# EasyEDA Pro project ProPrj_HEMY 2.0_2025-04-23.epro, schematic HEMY Brake Driver 1.1
Board Name: HEMY Brake Driver 1.1; Create Date: 2025-04-08; Page Name: Board; Project Name: HEMY 2.0; Schematic Name: HEMY Brake Driver 1.1; Update Date: 2025-04-08; Company: Club Astro Vélizy; Drawn: polvinc; Page Size: A5; Part Number: HEMY_BRAKE_001; Reviewed: polvinc; Version: V1.1
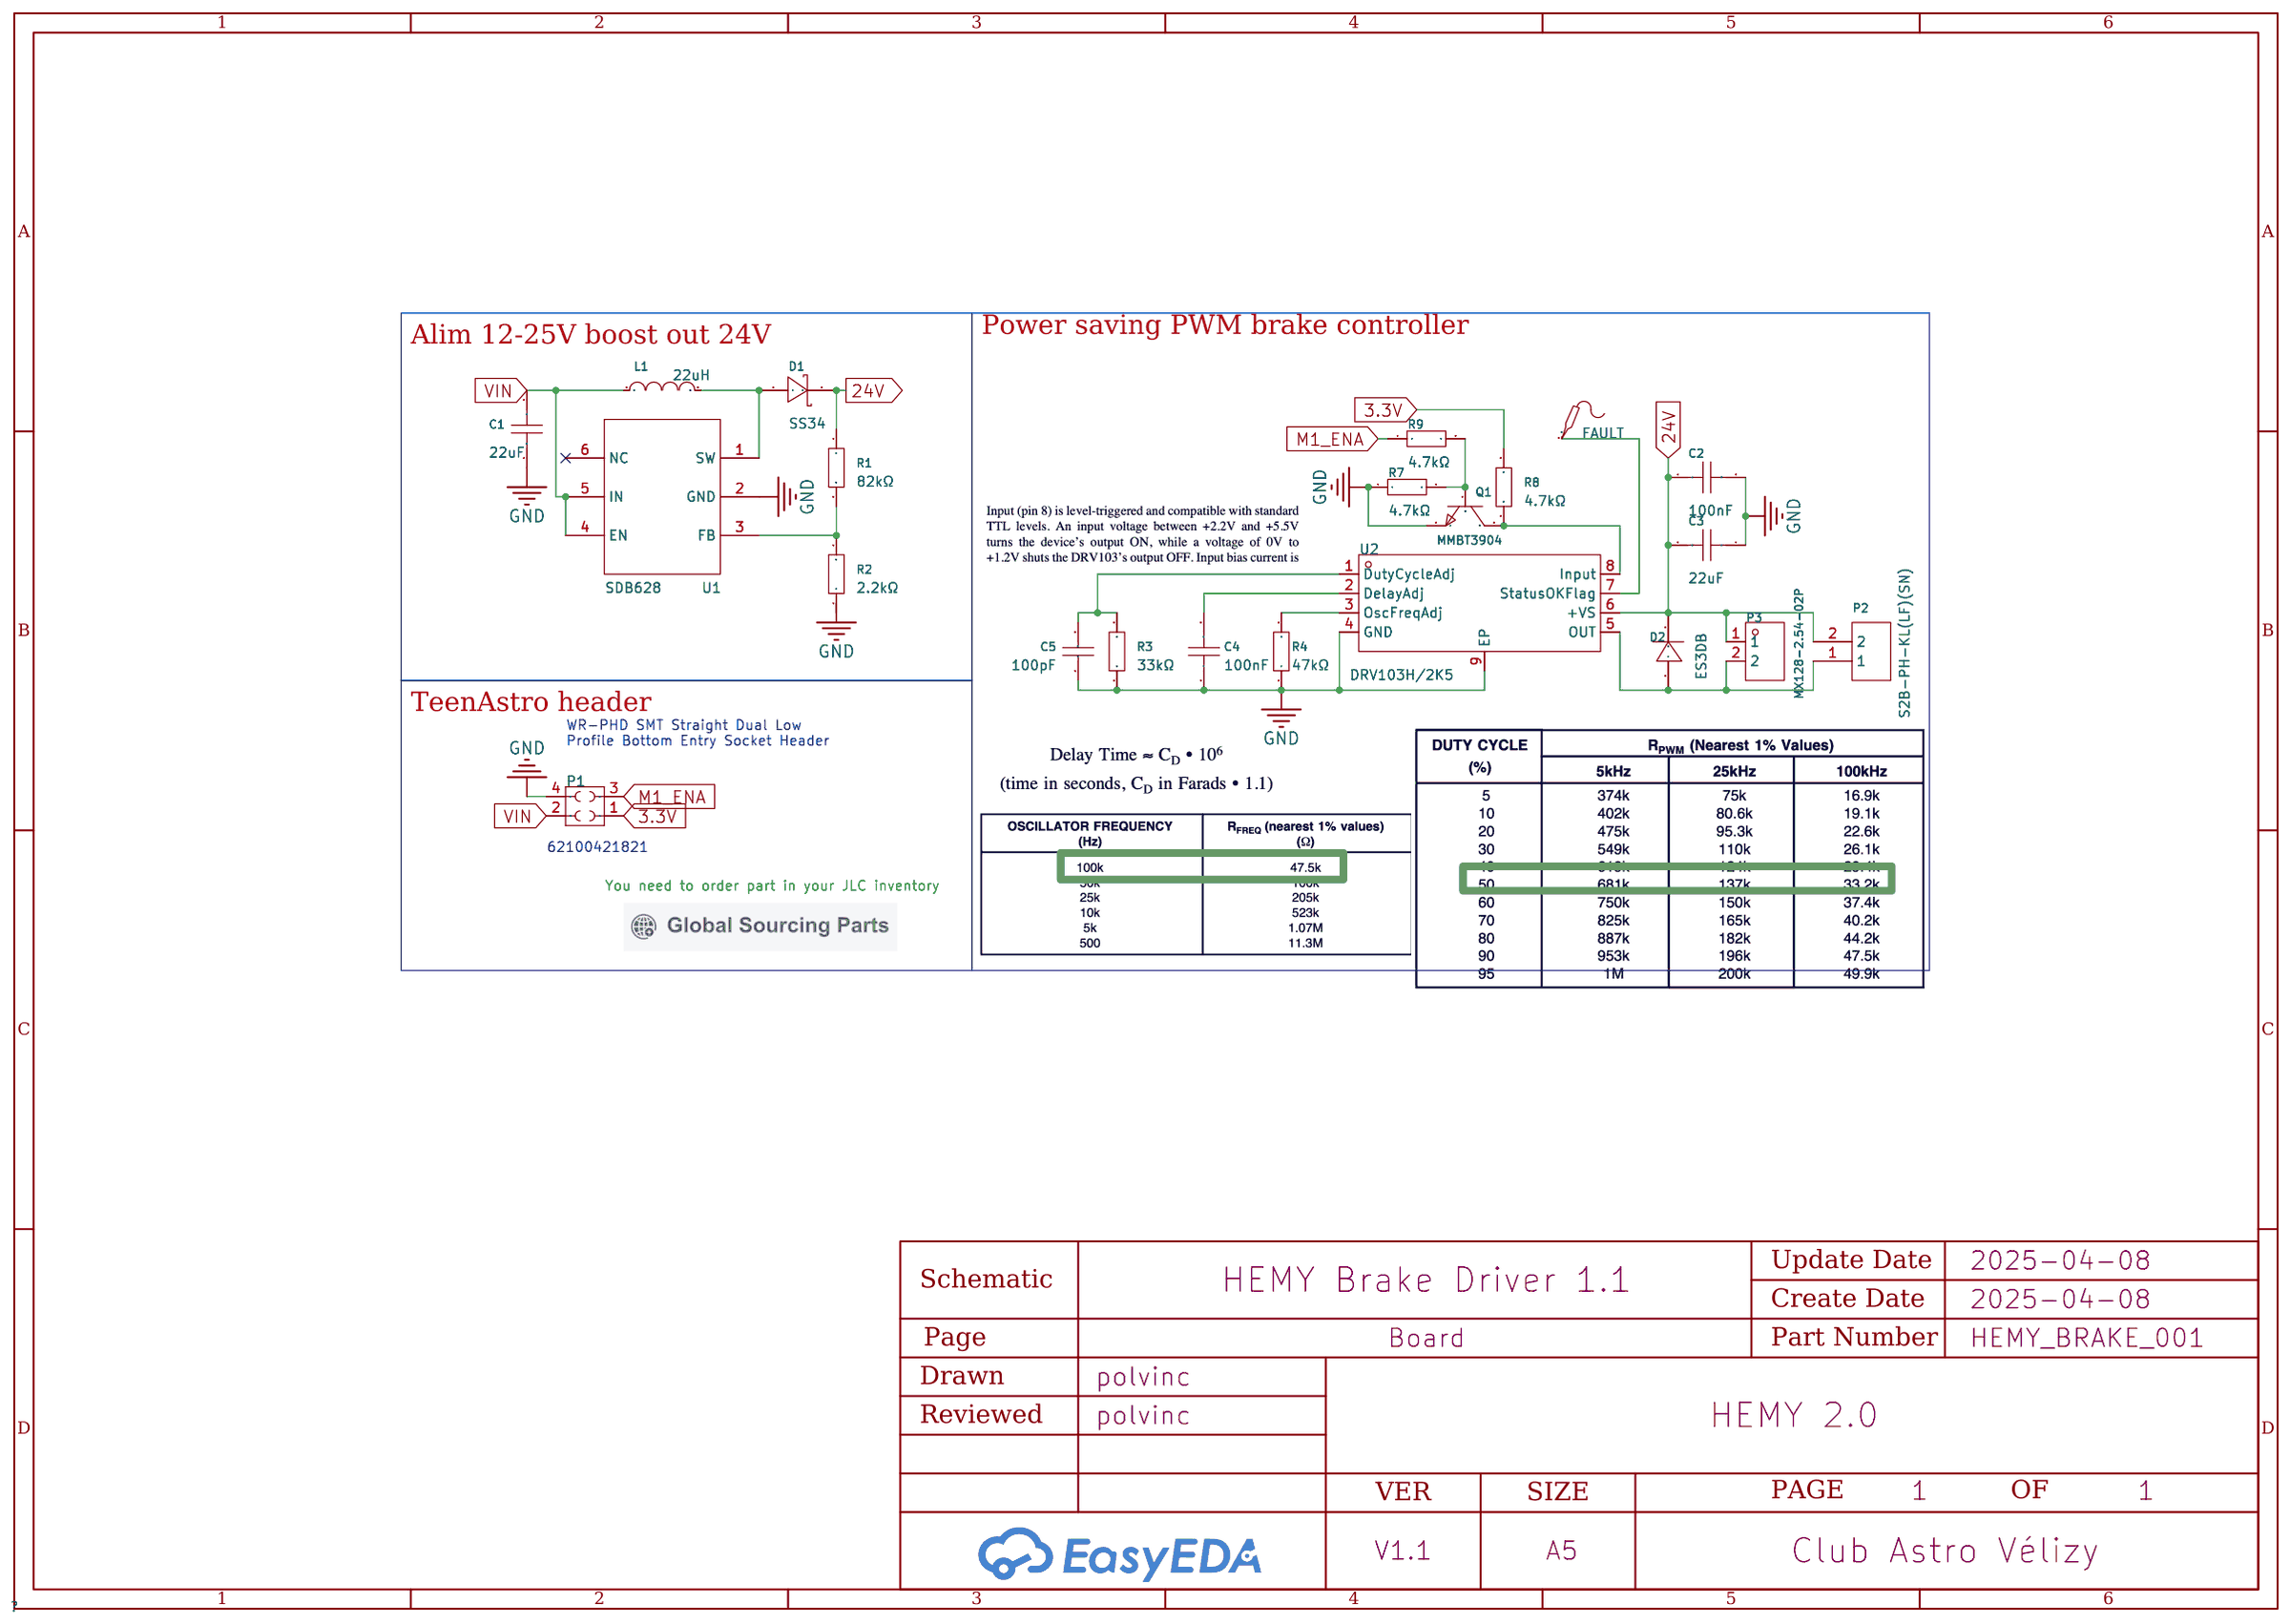
[diagram p2: schematic sheet]

## Parts
C1  22uF  [C0805]
C2  100nF  [C0805]
C3  22uF  [C0805]
C4  100nF  [C0603]
C5  100pF  [C0603]
D1  SS34  [SMA_L4.3-W2.6-LS5.2-RD]
D2  ES3DB  [SMB_L4.6-W3.6-LS5.3-RD]
FAULT  -  [Test-Point-0.5mm]
L1  22uH  [IND-SMD_L7.1-W6.6]
P1  -  [62100421821]
P2  S2B-PH-KL(LF)(SN)  [CONN-TH-2P-P2.00_S2B-PH-KL-LF-SN]  (no BOM)
P3  MX128-2.54-02P  [CONN-TH_2P-P2.54_MX128-2.54-GN01-02P-CU-Y-A]
Q1  MMBT3904  [SOT-23-3_L2.9-W1.3-P1.90-LS2.4-BR]
R1  82kΩ  [R0603]
R2  2.2kΩ  [R0603]
R3  33kΩ  [R0603]
R4  47kΩ  [R0603]
R7  4.7kΩ  [R0603]
R8  4.7kΩ  [R0603]
R9  4.7kΩ  [R0603]
U1  SDB628  [SOT-23-6_L2.9-W1.6-P0.95-LS2.8-BR]
U2  DRV103H/2K5  [SOIC-8_L4.9-W3.9-P1.27-LS6.0-BL-EP2.3]

## Library data of the parts
C1 C3 = CGA0805X5R226M350MT: Capacitance:22uF Tolerance:±20% Tolerance:±20% Voltage Rated: Temperature Coefficient:; LCSC Part Name: 22uF ±20% 35V; Supplier Part: C6119901; Manufacturer: HRE(芯声); Supplier Footprint: 0805; JLCPCB Part Class: Extended Part; Datasheet: https://atta.szlcsc.com/upload/public/pdf/source/20231129/D589D0CC4D260F7AC3A77E53B455CCB3.pdf; Supplier: LCSC; Tolerance: ±20%
C2 = CC0805KRX7R9BB104: Capacitance: Tolerance:±10% Tolerance:±10% Voltage Rated: Temperature Coefficient:; LCSC Part Name: 100nF ±10% 50V; Supplier Part: C49678; Manufacturer: YAGEO(国巨); Supplier Footprint: 0805; JLCPCB Part Class: Basic Part; Datasheet: https://atta.szlcsc.com/upload/public/pdf/source/20180224/C181747_15194369449651363981.pdf; Supplier: LCSC; Tolerance: ±10%
C4 = CC0603KRX7R9BB104: Capacitance: Tolerance:±10% Tolerance:±10% Voltage Rated: Temperature Coefficient:; LCSC Part Name: 100nF±10%50V; Supplier Part: C14663; Manufacturer: YAGEO(国巨); Supplier Footprint: 0603; JLCPCB Part Class: BasicPart; Datasheet: https://atta.szlcsc.com/upload/public/pdf/source/20180910/C282072_33301C7F631E79921B82A8DAC6BCC5B3.pdf; Supplier: LCSC; Tolerance: ±10%
C5 = CL10C101JB8NNNC: Capacitance: Tolerance:±5% Tolerance:±5% Voltage Rated: Temperature Coefficient:; LCSC Part Name: 100pF ±5% 50V; Supplier Part: C14858; Manufacturer: SAMSUNG(三星); Supplier Footprint: 0603; JLCPCB Part Class: Basic Part; Datasheet: https://atta.szlcsc.com/upload/public/pdf/source/20160103/1457707672333.pdf; Supplier: LCSC; Tolerance: ±5%
D1 = SS34_C8678: Diode Configuration:Single Forward Voltage (Vf@If):550mV@3A Reverse Voltage (Vr):40V Rectified Current:3A Reverse Leakage Current (Ir):500uA@40V; LCSC Part Name: 电压:40V 电流:3A; Supplier Part: C8678; Manufacturer: MDD(辰达半导体); Supplier Footprint: SMA(DO-214AC); JLCPCB Part Class: Basic Part; Datasheet: https://atta.szlcsc.com/upload/public/pdf/source/20230314/A80AE34493C69B89E2F4B1712F433538.pdf; Supplier: LCSC; Diode Configuration: Single; Forward Voltage (Vf@If): 550mV@3A; Reverse Voltage (Vr): 40V; Rectified Current: 3A; Reverse Leakage Current (Ir): 500uA@40V
D2 = ES3DB_C64975: Diode Configuration: Forward Voltage (Vf@If):1V@3A Reverse Voltage (Vr): Rectified Current: Reverse Leakage Current:5uA@200V Reverse Recovery Time (trr): Operating Temperature:-55℃~+150℃@(Tj) Operating Temperature:-55℃~+150℃@(Tj); LCSC Part Name: 电压:200V 电流:3A; Supplier Part: C64975; Manufacturer: MDD(辰达半导体); Supplier Footprint: DO-214AA(SMB); JLCPCB Part Class: Extended Part; Datasheet: https://atta.szlcsc.com/upload/public/pdf/source/20230314/57528205CBDE1D6077C2A8DCDEEC193A.pdf; Supplier: LCSC; Forward Voltage (Vf@If): 1V@3A; Reverse Leakage Current: 5uA@200V; Operating Temperature: -55℃~+150℃@(Tj)
FAULT = Test-Point: Test Point 测试点
L1 = YSPI0630A-220M: Inductance: Tolerance:±20% Tolerance:±20% Rated Current: DC Resistance (DCR):; LCSC Part Name: 22uH ±20%; Supplier Part: C497873; Manufacturer: YJYCOIN(益嘉源); Supplier Footprint: SMD,6.6x7.1mm; JLCPCB Part Class: Extended Part; Datasheet: https://atta.szlcsc.com/upload/public/pdf/source/20200317/C497869_D09F597887D5FB8B541C5C98B400E286.pdf; Supplier: LCSC; Tolerance: ±20%
P1 = 6210XX21821_62100421821_
P2 = S2B-PH-KL(LF)(SN): Pins Structure:1x2P Pitch:2mm Mounting Style:Right-Angle Reference Series:PH Number of Pins:2P Number of Rows:1 Number of PINs Per Row:2 Row Spacing:- Current Rating (Max):2A Contact Material:Copper Alloy Contact Plating:Tin Operating Temperature Range:-2; LCSC Part Name: 1x2P 间距:2mm 弯插 系列:PH; Supplier Part: C160237; Manufacturer: JST; Supplier Footprint: 弯插,P=2mm; JLCPCB Part Class: Extended Part; Datasheet: https://atta.szlcsc.com/upload/public/pdf/source/20181010/C265101_22107ACC4D8714694FDA2DD97145FA81.pdf; Supplier: LCSC; Pins Structure: 1x2P; Pitch: 2mm; Mounting Style: Right-Angle; Reference Series: PH; Number of Pins: 2P; Number of Rows: 1; Number of PINs Per Row: 2; Current Rating (Max): 2A; Contact Material: Copper Alloy; Contact Plating: Tin; Operating Temperature Range: -25℃~+85℃; Rated Voltage (Max): 100V; Plastic Material: PA66; Flame Retardant Rating: UL94V-0; Supplementary Features: 打K脚; Colour: Gray; Z-Height of the Board: 4.8mm; X-Length of Bottom Edge on Board (Spacing Line): 5.9mm; Y-Width of Bottom Edge on Board: 7.6mm
P3 = MX128-2.54-02P-GN01-Cu-Y-A: Structure:1x2P Pitch:2.54mm Color:Green Mounting Style:Straight Current Rating (Max):6A Voltage Rating (Max):150V Number of Pins:2P Number of Rows:1 Wire Gauge - AWG:18~24 Wire Gauge - AWG:18~24 Wire Gauge - mm2:1 Wire Gauge - mm2:1 Number of PINs Per Row; LCSC Part Name: 2.54mm 1x2P 排数:1 每排P数:2 直插; Supplier Part: C5188442; Manufacturer: MAX(迈旭); Supplier Footprint: 插件,P=2.54mm; JLCPCB Part Class: Extended Part; Datasheet: https://atta.szlcsc.com/upload/public/pdf/source/20230914/7C75AD31AD41EB9EF855A76DB002C0D2.pdf; Supplier: LCSC; Structure: 1x2P; Pitch: 2.54mm; Color: Green; Mounting Style: Straight; Current Rating (Max): 6A; Voltage Rating (Max): 150V; Number of Pins: 2P; Number of Rows: 1; Wire Gauge - AWG: 18~24; Wire Gauge - mm2: 1; Number of PINs Per Row: 2; Contact Material: Copper Alloy; Contact Plating: Tin; Operating Temperature Range: -40℃~+105℃
Q1 = MMBT3904_C20526: Transistor Type: Collector Current (Ic): Collector-Emitter Breakdown Voltage (Vceo): Power Dissipation (Pd): DC Current Gain (hFE@Ic,Vce):100@10mA,1V DC Current Gain (hFE@Ic,Vce):100@10mA,1V Transition Frequency (fT):300MHz Collector Cut-Off Current (Icbo; LCSC Part Name: NPN 电流:200mA 耐压:40V hfe=100~300; Supplier Part: C20526; Manufacturer: CJ(江苏长电/长晶); Supplier Footprint: SOT-23; JLCPCB Part Class: Basic Part; Datasheet: https://atta.szlcsc.com/upload/public/pdf/source/20220704/70F575FB75061E03F919270A6BB8BA7F.pdf; Supplier: LCSC; DC Current Gain (hFE@Ic,Vce): 100@10mA,1V; Transition Frequency (fT): 300MHz; Collector Cut-Off Current (Icbo): 100nA; Collector-Emitter Saturation Voltage (VCE(sat)@Ic,Ib): 300mV@50mA,5mA
R1 = 0603WAF8202T5E: Type:Thick Film Resistors Resistance:82kΩ Tolerance:±1% Tolerance:±1% Power(Watts): Overload Voltage (Max): Temperature Coefficient:±100ppm/℃ Temperature Coefficient:±100ppm/℃ Operating Temperature Range:-55℃~+155℃ Operating Temperature Range:-55℃~+155℃; LCSC Part Name: 82kΩ ±1% 100mW 厚膜电阻; Supplier Part: C23254; Manufacturer: UNI-ROYAL(厚声); Supplier Footprint: 0603; JLCPCB Part Class: Basic Part; Datasheet: https://atta.szlcsc.com/upload/public/pdf/source/20200306/C422600_1E6D84923E4A46A82E41ADD87F860B5C.pdf; Supplier: LCSC; Type: Thick Film Resistors; Tolerance: ±1%; Temperature Coefficient: ±100ppm/℃; Operating Temperature Range: -55℃~+155℃
R2 = 0603WAF2201T5E_C4190: Type:Thick Film Resistors Resistance:2.2kΩ Tolerance:±1% Tolerance:±1% Power(Watts): Overload Voltage (Max): Temperature Coefficient:±100ppm/℃ Temperature Coefficient:±100ppm/℃ Operating Temperature Range:-55℃~+155℃ Operating Temperature Range:-55℃~+155℃; LCSC Part Name: 2.2kΩ ±1% 100mW 厚膜电阻; Supplier Part: C4190; Manufacturer: UNI-ROYAL(厚声); Manufacturer Part: 0603WAF2201T5E; Supplier Footprint: 0603; JLCPCB Part Class: Basic Part; Datasheet: https://atta.szlcsc.com/upload/public/pdf/source/20200306/C422600_1E6D84923E4A46A82E41ADD87F860B5C.pdf; Supplier: LCSC; Type: Thick Film Resistors; Tolerance: ±1%; Temperature Coefficient: ±100ppm/℃; Operating Temperature Range: -55℃~+155℃
R3 = 0603WAF3302T5E: Type:Thick Film Resistors Resistance:33kΩ Tolerance:±1% Tolerance:±1% Power(Watts): Overload Voltage (Max): Temperature Coefficient:±100ppm/℃ Temperature Coefficient:±100ppm/℃ Operating Temperature Range:-55℃~+155℃ Operating Temperature Range:-55℃~+155℃; LCSC Part Name: 33kΩ ±1% 100mW 厚膜电阻; Supplier Part: C4216; Manufacturer: UNI-ROYAL(厚声); Supplier Footprint: 0603; JLCPCB Part Class: Basic Part; Datasheet: https://atta.szlcsc.com/upload/public/pdf/source/20200306/C422600_1E6D84923E4A46A82E41ADD87F860B5C.pdf; Supplier: LCSC; Type: Thick Film Resistors; Tolerance: ±1%; Temperature Coefficient: ±100ppm/℃; Operating Temperature Range: -55℃~+155℃
R4 = 0603WAF4702T5E: Type:Thick Film Resistors Resistance:47kΩ Tolerance:±1% Tolerance:±1% Power(Watts): Overload Voltage (Max): Temperature Coefficient:±100ppm/℃ Temperature Coefficient:±100ppm/℃ Operating Temperature Range:-55℃~+155℃ Operating Temperature Range:-55℃~+155℃; LCSC Part Name: 47kΩ ±1% 100mW 厚膜电阻; Supplier Part: C25819; Manufacturer: UNI-ROYAL(厚声); Supplier Footprint: 0603; JLCPCB Part Class: Basic Part; Datasheet: https://atta.szlcsc.com/upload/public/pdf/source/20200306/C422600_1E6D84923E4A46A82E41ADD87F860B5C.pdf; Supplier: LCSC; Type: Thick Film Resistors; Tolerance: ±1%; Temperature Coefficient: ±100ppm/℃; Operating Temperature Range: -55℃~+155℃
R7-R9 = 0603WAF4701T5E: Type:Thick Film Resistors Resistance:4.7kΩ Tolerance:±1% Tolerance:±1% Power(Watts): Overload Voltage (Max): Temperature Coefficient:±100ppm/℃ Temperature Coefficient:±100ppm/℃ Operating Temperature Range:-55℃~+155℃ Operating Temperature Range:-55℃~+155℃; LCSC Part Name: 4.7kΩ ±1% 100mW 厚膜电阻; Supplier Part: C23162; Manufacturer: UNI-ROYAL(厚声); Supplier Footprint: 0603; JLCPCB Part Class: Basic Part; Datasheet: https://atta.szlcsc.com/upload/public/pdf/source/20200306/C422600_1E6D84923E4A46A82E41ADD87F860B5C.pdf; Supplier: LCSC; Type: Thick Film Resistors; Tolerance: ±1%; Temperature Coefficient: ±100ppm/℃; Operating Temperature Range: -55℃~+155℃
U1 = SDB628: Function:boost converterType Input Voltage:2V~24V Input Voltage:2V~24V Output Voltage:28V Output Voltage:28V Output Current (Max):2A Switching Frequency:1.2MHz Synchronous Rectification:NO Number of Outputs:1 Topology:Boost Switch tube (built-in/external); Supplier Part: C77805; Manufacturer: SHOUDING(首鼎半导体); Supplier Footprint: SOT-23-6; JLCPCB Part Class: Extended Part; Datasheet: https://atta.szlcsc.com/upload/public/pdf/source/20160823/1471947522087.pdf; Supplier: LCSC; Function: boost converterType; Input Voltage: 2V~24V; Output Voltage: 28V; Output Current (Max): 2A; Switching Frequency: 1.2MHz; Synchronous Rectification: NO; Number of Outputs: 1; Topology: Boost; Switch tube (built-in/external): 内置
U2 = DRV103H/2K5: Supplier Part: C544418; Manufacturer: TI(德州仪器); Supplier Footprint: SOIC-8-EP; JLCPCB Part Class: Extended Part; Datasheet: https://www.ti.com/cn/lit/gpn/drv103; Supplier: LCSC

## Nets
3.3V: P1.1 R8.2
24V: C2.1 C3.2 D1.1(K) D2.1(C) P2.2 P3.1 R1.1 U2.6(+VS)
GND: C1.1 C2.2 C3.1 C4.1 C5.1 P1.4 Q1.2(E) R2.1 R3.1 R4.1 R7.1 U1.2(GND) U2.4(GND) U2.9(EP)
VIN: C1.2 L1.1 P1.2 U1.4(EN) U1.5(IN)
M1_ENA: P1.3 R9.1
$1N4023: R4.2 U2.3(OscFreqAdj)
$1N4066: C5.2 R3.2 U2.1(DutyCycleAdj)
$1N4441: Q1.3(C) R8.1 U2.8(Input)
$1N5858: D1.2(A) L1.2 U1.1(SW)
$1N9857: R1.2 R2.2 U1.3(FB)
$1N10088: C4.2 U2.2(DelayAdj)
$1N16383: FAULT.1 U2.7(StatusOKFlag)
$1N19329: Q1.1(B) R7.2 R9.2
Net-(D2-2): D2.2(A) P2.1 P3.2 U2.5(OUT)

Not connected (* = marked no-connect by the designer): U1 6(NC)*

## Notes on the sheet
- Power saving PWM brake controller
- Alim 12-25V boost out 24V
- TeenAstro header
- WR-PHD SMT Straight Dual Low
  Profile Bottom Entry Socket Header
- 62100421821
- You need to order part in your JLC inventory
